# Altium project PIEZO-BUTTON.PRJPCB
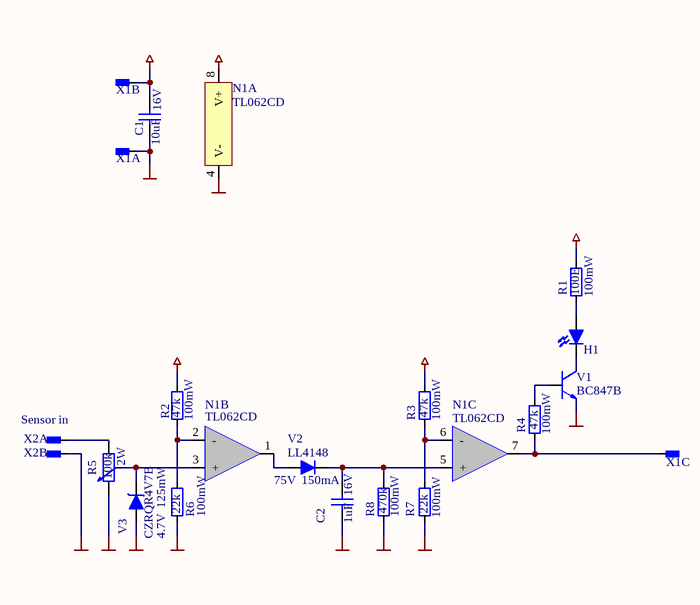
[diagram p0: piezo-button-sheet1.SchDoc]
1 sheet, 17 parts. Net scope: global (net labels, ports and power ports of the same name join across sheets).
Board file: piezo-button-pcb1.PcbDoc

## Sheet piezo-button-sheet1.SchDoc
size B

### Parts
C1  value 10uF  Value2: 16V  [SMD_0805]  (hidden comment: C_SMD_CER_10U_16V_10%_X5R_0805)
C2  value 1uF  Value2: 16V  [SMD_0603]  (hidden comment: C_SMD_CER_1U_16V_10%_X5R_0603)
H1  H_SMD_LED_GREEN_1206  [SMD_1206_BOTTOM_ENTRY]  (value not drawn)
N1  Type: TL062CD  [SMD_SOP_8]  (hidden comment: N_TL062CD_SOP-8)  (parts A,B,C of 3)
R1  value 100E  Value2: 100mW  [SMD_0603]  (hidden comment: R_SMD_THINFILM_100E_0W1_1%_50PPM_0603)
R2  value 47k  Value2: 100mW  [SMD_0603]  (hidden comment: R_SMD_THINFILM_47K_0W1_1%_50PPM_0603)
R3  value 47k  Value2: 100mW  [SMD_0603]  (hidden comment: R_SMD_THINFILM_47K_0W1_1%_50PPM_0603)
R4  value 47k  Value2: 100mW  [SMD_0603]  (hidden comment: R_SMD_THINFILM_47K_0W1_1%_50PPM_0603)
R5  value 100k  Value2: 2W  [THT_CON_P2.54_D0.9_1X3]  (hidden comment: R_THT_POT_100K_2W_10%_150PPM)
R6  value 22k  Value2: 100mW  [SMD_0603]  (hidden comment: R_SMD_THINFILM_22K_0W1_1&_50PPM_0603)
R7  value 22k  Value2: 100mW  [SMD_0603]  (hidden comment: R_SMD_THINFILM_22K_0W1_1&_50PPM_0603)
R8  value 470k  Value2: 100mW  [SMD_0603]  (hidden comment: R_SMD_THINFILM_470K_0W1_1%_50PPM_0603)
V1  Type: BC847B  [SMD_SOT_23_3]  (hidden comment: V_SMD_TRANS_NPN_BC847B_50V_0A2_SOT-23-3)
V2  value 75V  Type: LL4148  Value2: 150mA  [SMD_SOD_80P]  (hidden comment: V_SMD_DIODE_LL4148_75V_0A15_SOD-80)
V3  value 4.7V  Type: CZRQR4V7B  Value2: 125mW  [SMD_0402P]  (hidden comment: V_SMD_Z-DIODE_4V7_0W125_0402)
X1  X_CONNECTOR_P2.54_D0.9_1X3  [THT_CON_P2.54_D0.9_1X3]  (value not drawn)  (parts A,B,C of 3)
X2  X_CONNECTOR_P2.54_D0.9_1X2  [THT_CON_P2.54_D0.9_1X2]  (value not drawn)  (parts A,B of 2)

### Nets
GND: C1.1 C2.1 N1.4(V-) R5.1(NC) R6.1 R7.1 R8.1 V1.2(E) V3.1 X1.1 X2.2
VCC: C1.2 N1.8(V+) R1.2 R2.2 R3.2 X1.2
NetC2_2: C2.2 N1.5(+) R8.2 V2.2
NetH1_1: H1.1 R1.1
NetH1_2: H1.2 V1.3(C)
NetN1_1: N1.1(OUT-A) V2.1
NetN1_2: N1.2(-) R2.1 R6.2
NetN1_3: N1.3(+) R5.2(NC) V3.2
NetN1_6: N1.6(-) R3.1 R7.2
NetN1_7: N1.7(OUT-B) R4.1 X1.3
NetR4_2: R4.2 V1.1(B)
NetR5_3: R5.3(NC) X2.1

### Notes on the sheet
- (near X2) Sensor in

### Library data of the parts
C1 = C_SMD_CER_10U_16V_10%_X5R_0805: SMD Capacitor; Supplier - E+H-flowtec SAP: 71107344
C2 = C_SMD_CER_1U_16V_10%_X5R_0603: SMD Capacitor; Supplier - E+H-flowtec SAP: 50106956
H1 = H_SMD_LED_GREEN_1206: LED GREEN CLEAR 1206 REV MT SMD; Supplier - Digikey: 160-1456-1-ND
N1 = N_TL062CD_SOP-8: Low-power JFET dual operation amplifier; Supplier - E+H-flowtec SAP: 50020349
R1 = R_SMD_THINFILM_100E_0W1_1%_50PPM_0603: SMD Resistor; Supplier - E+H-flowtec SAP: 50092674
R2-R4 = R_SMD_THINFILM_47K_0W1_1%_50PPM_0603: SMD Resistor; Supplier - E+H-flowtec SAP: 50092708
R5 = R_THT_POT_100K_2W_10%_150PPM: POT 100K OHM 3/4" RD CERM; Type: 3856A-282-104AL; Supplier - Digikey: 3856A-282-104AL-ND
R6 R7 = R_SMD_THINFILM_22K_0W1_1&_50PPM_0603: SMD Resistor; Supplier - E+H-flowtec SAP: 50092704
R8 = R_SMD_THINFILM_470K_0W1_1%_50PPM_0603: SMD Resistor; Supplier - E+H-flowtec SAP: 50092722
V1 = V_SMD_TRANS_NPN_BC847B_50V_0A2_SOT-23-3: NPN Transistor; Supplier - E+H-flowtec SAP: 50019820
V3 = V_SMD_Z-DIODE_4V7_0W125_3%_0402: Zener Diode; Supplier - Digikey: CZRQR4V7B-HF-ND
X1 = X_CONNECTOR_P2.54_D0.9_1X3: Pitch 2.54, Diameter 0.9mm, 1 row, 3 columns; Type: Pitch 2.54, Diameter 0.9mm, 1 row, 3 columns
X2 = X_CONNECTOR_P2.54_D0.9_1X2: Pitch 2.54, Diameter 0.9mm, 1 row, 2 columns; Type: Pitch 2.54, Diameter 0.9mm, 1 row, 2 columns
V2 = V_SMD_DIODE_LL4148_75V_0A15_SOD-80: Supplier - E+H-flowtec SAP: 50019426